# EAGLE schematic cozypad (EAGLE 9.5.2)
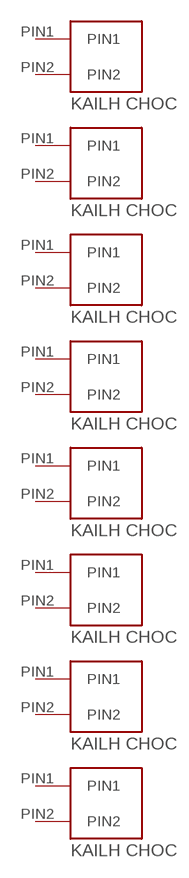
[diagram p0: schematic, sheet 1]

## Parts
U$1  KAILH_CHOC_LP  [KAILH_CHOC_LP]
U$2  KAILH_CHOC_LP  [KAILH_CHOC_LP]
U$3  KAILH_CHOC_LP  [KAILH_CHOC_LP]
U$4  KAILH_CHOC_LP  [KAILH_CHOC_LP]
U$5  KAILH_CHOC_LP  [KAILH_CHOC_LP]
U$6  KAILH_CHOC_LP  [KAILH_CHOC_LP]
U$7  KAILH_CHOC_LP  [KAILH_CHOC_LP]
U$8  KAILH_CHOC_LP  [KAILH_CHOC_LP]
Unconnected: U$1.PIN1 U$1.PIN2 U$2.PIN1 U$2.PIN2 U$3.PIN1 U$3.PIN2 U$4.PIN1 U$4.PIN2 U$5.PIN1 U$5.PIN2 U$6.PIN1 U$6.PIN2 U$7.PIN1 U$7.PIN2 U$8.PIN1 U$8.PIN2

## Library data of the parts
U$1-U$8 = kailh-switches:KAILH_CHOC_LP